# Altium schematic sheet МПСУ.464342.21-005Э3 Лист2.SchDoc
size 297 x 209 mm; Address1: Address1; Address2: Address2; Address3: Address3; Address4: Address4; SheetNumber: 3; SheetTotal: 5; Scale: 1:1; Обозначение документа: МПСУ.464342.21-005 Э3
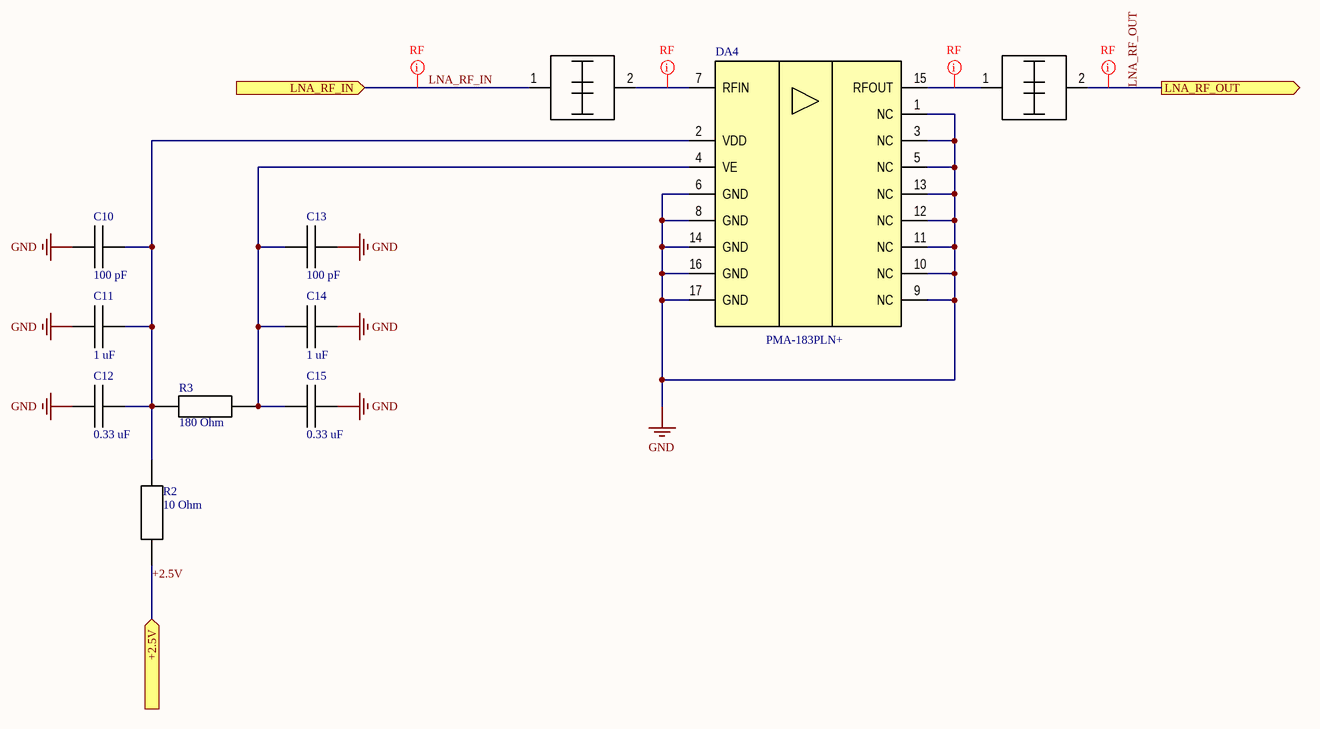
[diagram p0: МПСУ.464342.21-005Э3 Лист2.SchDoc]

## Parts
C10  100 pF  [CAPC100X50X55L20N]
C11  1 uF  [CAPC160X80X90L30N]
C12  0.33 uF  [CAPC200X125X95L50N]
C13  100 pF  [CAPC100X50X55L20N]
C14  1 uF  [CAPC160X80X90L30N]
C15  0.33 uF  [CAPC200X125X95L50N]
DA4  PMA-183PLN+  [JV2579]
R2  10 Ohm  [RESC100X50X40L25N]
R3  180 Ohm  [RESC100X50X40L25N]
W4  Matching  [MATCHING_LNA_IN]  (value not drawn)  (net tie, no BOM)
W5  Matching  [MATCHING_LNA_OUT]  (value not drawn)  (net tie, no BOM)

## Ports
+2.5V (in), LNA_RF_IN (in), LNA_RF_OUT (out)

## Nets
GND: C10.1 C11.1 C12.1 C13.2 C14.2 C15.2 DA4.1(NC) DA4.3(NC) DA4.5(NC) DA4.6(GND) DA4.8(GND) DA4.9(NC) DA4.10(NC) DA4.11(NC) DA4.12(NC) DA4.13(NC) DA4.14(GND) DA4.16(GND) DA4.17(GND)
+2.5V: R2.1 ; port +2.5V
LNA_RF_IN: W4.1 ; port LNA_RF_IN
LNA_RF_OUT: W5.2 ; port LNA_RF_OUT
NetC10_2: C10.2 C11.2 C12.2 DA4.2(VDD) R2.2 R3.1
NetC13_1: C13.1 C14.1 C15.1 DA4.4(VE) R3.2
NetDA4_7: DA4.7(RFIN) W4.2
NetDA4_15: DA4.15(RFOUT) W5.1

## Layout directives
net class RF: LNA_RF_IN, LNA_RF_OUT, NetDA4_7, NetDA4_15

## Notes on the sheet
- Подп. и дата
- Инв. № дубл.
- Взам. инв. №
- Инв. № подл.
- Изм.
- Лист
- № докум.
- Подп.
- Дата
- Копировал
- Формат А4

## Library data of the parts
C10 C12 C13 C15 = Capacitor: Capacitor, generic; Tolerance: ± %10; PartNumber: *; VDC: *; Dielectric: *; Manufacturer: *
  C10 C13: Value: 100 pF; Package: 0402
  C12 C15: Value: 0.33 uF; Package: 0805
C11 C14 = Capacitor: Capacitor, generic; PartNumber: X5R; Tolerance: ± %10; VDC: 10 V; Value: 1 uF; Dielectric: *; Manufacturer: *; Package: 0603
DA4 = PMA-183PLN+: SMT Low Noise Amplifier, 6000 - 18000 MHz, 50Ω; Manufacturer: Mini-Circuits; PartNumber: PMA-183PLN+; ComponentLink1Description: ProductPage; ComponentLink1URL: https://www.minicircuits.com/WebStore/dashboard.html?model=PMA-183PLN%2B
R2 R3 = Resistor: Resistor, generic; Tolerance: ± 5%; Power: 63 mW; DCV: 25V; PartNumber: *; Manufacturer: *; Package: 0402
  R2: Value: 10 Ohm
  R3: Value: 180 Ohm
W4 W5 = Matching_1: Matching MTEE